# EAGLE schematic hyundai (EAGLE 9.1.0)
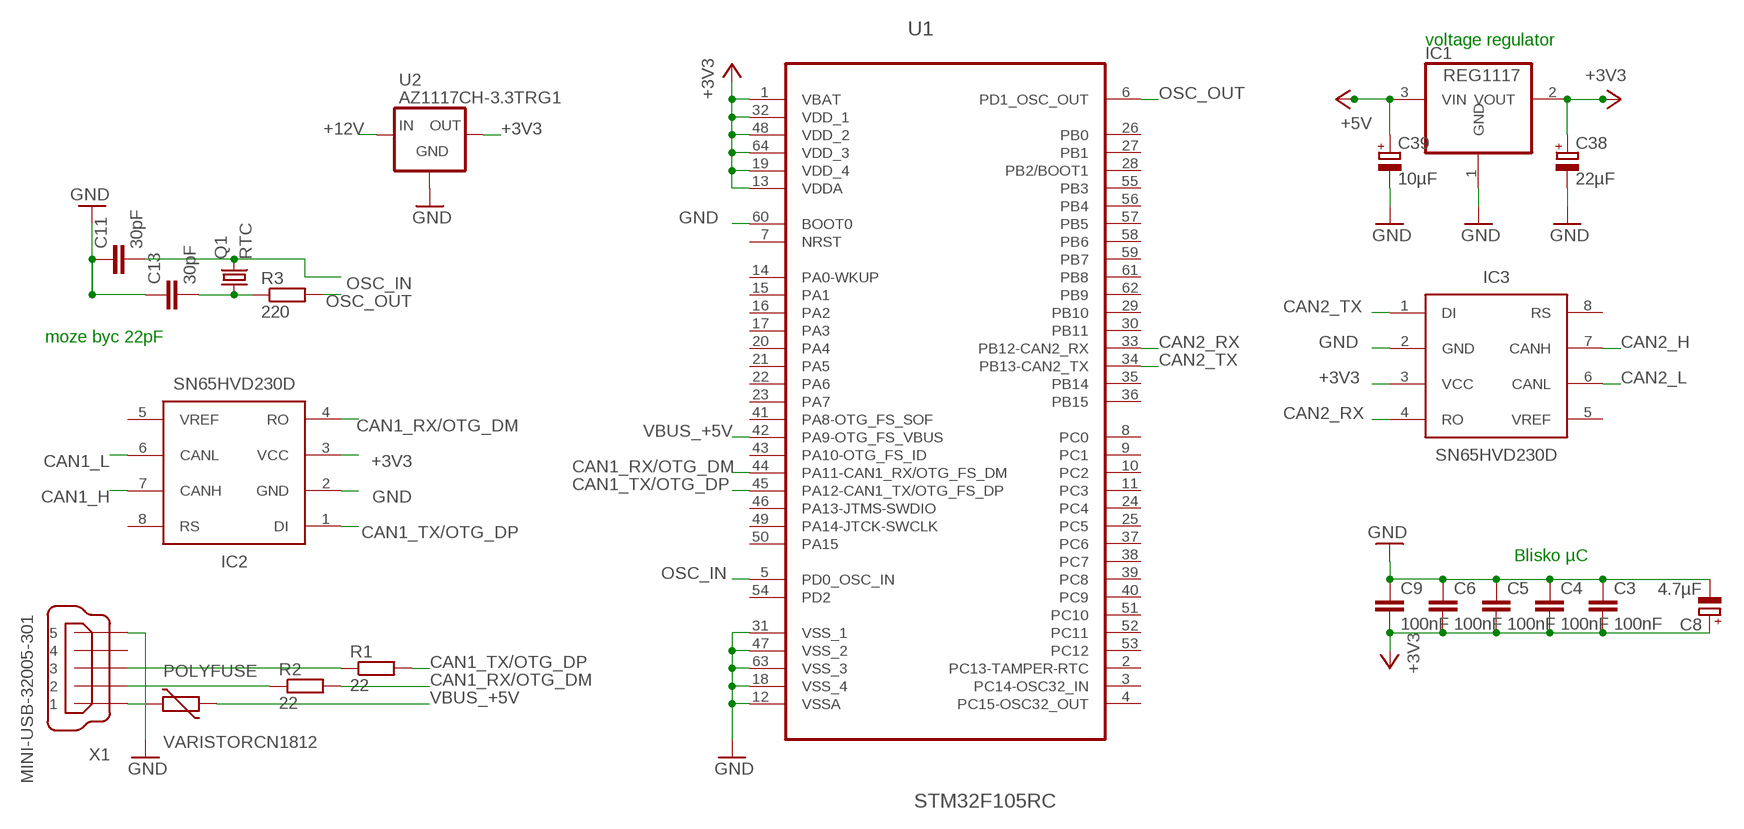
[diagram p0: schematic, sheet 1]

## Parts
C3  100nF  C-EUC0603  [C0603]
C4  100nF  C-EUC0603  [C0603]
C5  100nF  C-EUC0603  [C0603]
C6  100nF  C-EUC0603  [C0603]
C8  4.7µF  CPOL-EUA/3216-18R  [A/3216-18R]
C9  100nF  C-EUC0603  [C0603]
C11  30pF  C-EUC0603  [C0603]
C13  30pF  C-EUC0603  [C0603]
C38  22µF  CPOL-EUB/3528-21W  [B/3528-21W]
C39  10µF  CPOL-EUB/3528-21W  [B/3528-21W]
IC1  REG1117  [SOT223]
IC2  SN65HVD230D  [SO-8]
IC3  SN65HVD230D  [SO-8]
POLYFUSE  VARISTORCN1812  [CT/CN1812]
Q1  RTC  CRYSTALHC49S  [HC49/S]
R1  22  R-EU_R0805  [R0805]
R2  22  R-EU_R0805  [R0805]
R3  220  R-EU_R0603  [R0603]
U1  STM32F105RC  [QFP50P1200X1200X160-64N]
U2  AZ1117CH-3.3TRG1  [SOT-223]
X1  MINI-USB-32005-301  [32005-301]

## Nets
+3V3: C3.2 C4.2 C5.2 C6.2 C8.+ C9.2 C38.+ IC1.2(VOUT) IC2.3(VCC) IC3.3(VCC) U1.1(VBAT) U1.13(VDDA) U1.19(VDD_4) U1.32(VDD_1) U1.48(VDD_2) U1.64(VDD_3) U2.2(OUT) U2.4(OUT)
+5V: C39.+ IC1.3(VIN)
+12V: U2.3(IN)
CAN1_H: IC2.7(CANH)
CAN1_L: IC2.6(CANL)
CAN1_RX/OTG_DM: IC2.4(RO) R2.2 U1.44(PA11-CAN1_RX/OTG_FS_DM)
CAN1_TX/OTG_DP: IC2.1(DI) R1.2 U1.45(PA12-CAN1_TX/OTG_FS_DP)
CAN2_H: IC3.7(CANH)
CAN2_L: IC3.6(CANL)
CAN2_RX: IC3.4(RO) U1.33(PB12-CAN2_RX)
CAN2_TX: IC3.1(DI) U1.34(PB13-CAN2_TX)
GND: C3.1 C4.1 C5.1 C6.1 C8.- C9.1 C11.1 C13.1 C38.- C39.- IC1.1(GND) IC2.2(GND) IC3.2(GND) U1.12(VSSA) U1.18(VSS_4) U1.31(VSS_1) U1.47(VSS_2) U1.60(BOOT0) U1.63(VSS_3) U2.1(GND) X1.5
N$1: C13.2 Q1.1 R3.1
N$6: R1.1 X1.3
N$7: R2.1 X1.2
N$10: POLYFUSE.2 X1.1
OSC_IN: C11.2 Q1.2 U1.5(PD0_OSC_IN)
OSC_OUT: R3.2 U1.6(PD1_OSC_OUT)
VBUS_+5V: POLYFUSE.1 U1.42(PA9-OTG_FS_VBUS)
Unconnected: IC2.5(VREF) IC2.8(RS) IC3.5(VREF) IC3.8(RS) U1.2(PC13-TAMPER-RTC) U1.3(PC14-OSC32_IN) U1.4(PC15-OSC32_OUT) U1.7(NRST) U1.8(PC0) U1.9(PC1) U1.10(PC2) U1.11(PC3) U1.14(PA0-WKUP) U1.15(PA1) U1.16(PA2) U1.17(PA3) U1.20(PA4) U1.21(PA5) U1.22(PA6) U1.23(PA7) U1.24(PC4) U1.25(PC5) U1.26(PB0) U1.27(PB1) U1.28(PB2/BOOT1) U1.29(PB10) U1.30(PB11) U1.35(PB14) U1.36(PB15) U1.37(PC6) U1.38(PC7) U1.39(PC8) U1.40(PC9) U1.41(PA8-OTG_FS_SOF) U1.43(PA10-OTG_FS_ID) U1.46(PA13-JTMS-SWDIO) U1.49(PA14-JTCK-SWCLK) U1.50(PA15) U1.51(PC10) U1.52(PC11) U1.53(PC12) U1.54(PD2) U1.55(PB3) U1.56(PB4) U1.57(PB5) U1.58(PB6) U1.59(PB7) U1.61(PB8) U1.62(PB9) X1.4

## Notes on the sheet
- voltage regulator
- moze byc 22pF
- Blisko µC

## Library data of the parts
C3-C6 C9 C11 C13 = rcl:C-EU: CAPACITOR, European symbol; SPICEPREFIX: C
C8 C38 C39 = rcl:CPOL-EU: POLARIZED CAPACITOR, European symbol; SPICEPREFIX: C
IC1 = burr-brown:REG1117: 800mA and 1A Low Dropout (LDO) Positive Regulator 1.8V, 2.5V, 2.85V, 3.3V, 5V, and Adj; MPN: REG1117; OC_FARNELL: 1097566; OC_NEWARK: 14P6981
IC2 IC3 = misaka:SN65HVD23*D: 3.3V CAN Bus Transceiver Supply voltage: 3...3.6V Max rate: 1Mbps Standby mode(SN65HVD230D) Sleep mode(SN65HVD231D) Slope control mode
POLYFUSE = varistor:VARISTOR: VARISTOR
Q1 = crystal:CRYSTAL: CRYSTAL; OC_FARNELL: 1667008; OC_NEWARK: unknown
R1 R2 = resistor:R-EU_: RESISTOR, European symbol
R3 = rcl:R-EU_: RESISTOR, European symbol; SPICEPREFIX: R
U1 = steer:STM32F105RC: ARM-based 32-bit MCU; MPN: STM32F105RBT6; OC_FARNELL: 1737133; OC_NEWARK: 25R9437; PACKAGE: LQFP-64; SUPPLIER: STMicroelectronics
U2 = misaka:AZ1117CH-3.3
X1 = con-cypressindustries:MINI-USB-: MINI USB-B Conector Source: www.cypressindustries.com; OC_FARNELL: unknown; OC_NEWARK: unknown